# EAGLE design rifting_bronx_eden (EAGLE 9.6.2)
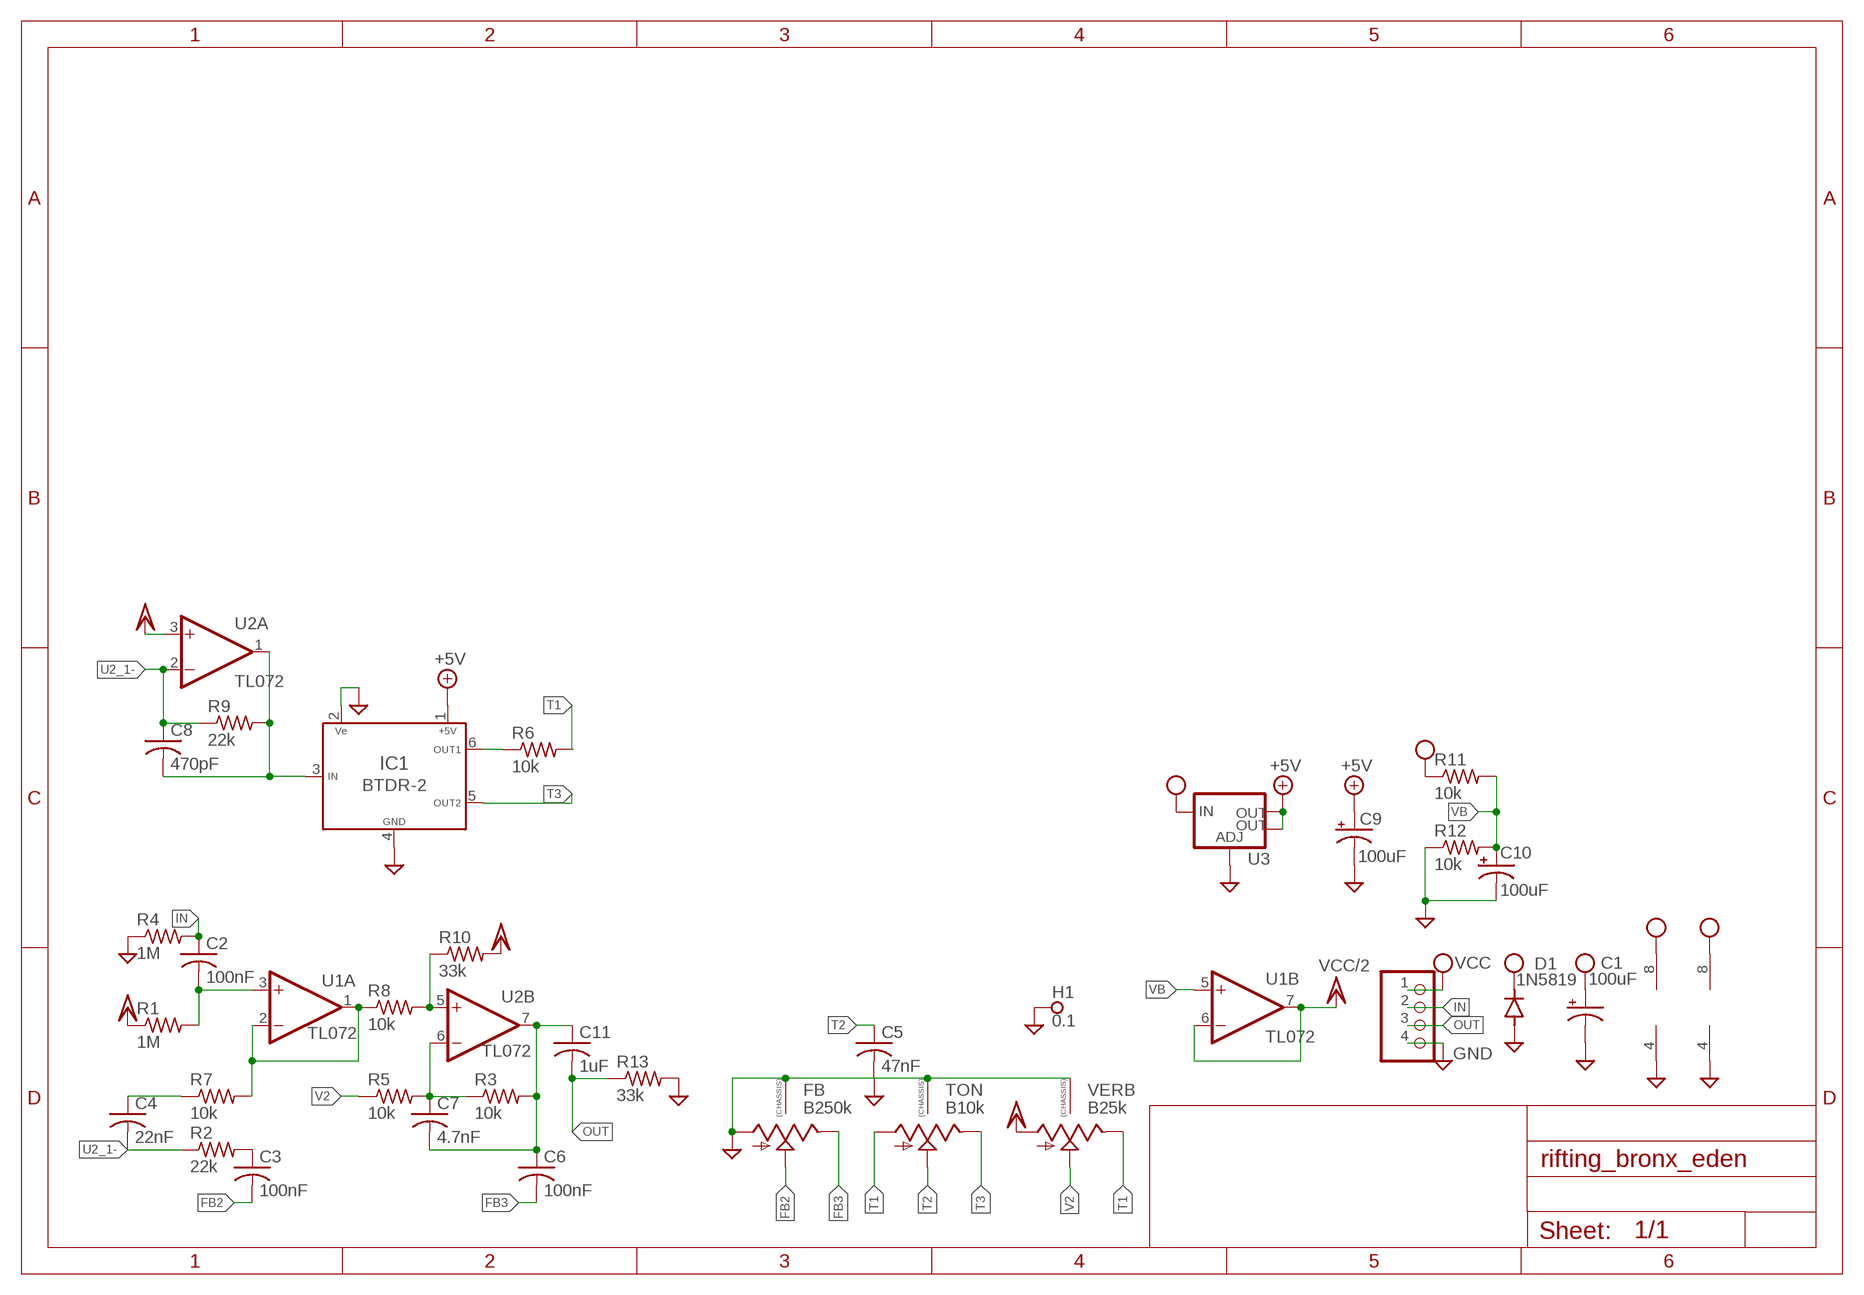
[diagram p0: schematic, sheet 1]

## Parts
C1  100uF  CAP_SMD+THRUPAN_B  [PAN_B_SMD+THRU]
C2  100nF  C-USC0603  [C0603]
C3  100nF  C-USC0603  [C0603]
C4  22nF  C-USC0603  [C0603]
C5  47nF  C-USC0603  [C0603]
C6  100nF  C-USC0603  [C0603]
C7  4.7nF  C-USC0603  [C0603]
C8  470pF  C-USC0603  [C0603]
C9  100uF  CAP_SMD+THRUPAN_B  [PAN_B_SMD+THRU]
C10  100uF  CAP_SMD+THRUPAN_B  [PAN_B_SMD+THRU]
C11  1uF  C-USC0603  [C0603]
D1  1N5819  DIODE-SOD123  [SOD123]
FB  B250k  9MM_SNAP-IN_POT_CHASSIS  [9MM_SNAP-IN_POT]
H1  0.1  SPECIAL_DRILL_0.1000  [PAD_0.1000]
IC1  BTDR-2  [BTDR-2]
JP1  PINHD-1X4  [1X04]
R1  1M  R-US_R0603  [R0603]
R2  22k  R-US_R0603  [R0603]
R3  10k  R-US_R0603  [R0603]
R4  1M  R-US_R0603  [R0603]
R5  10k  R-US_R0603  [R0603]
R6  10k  R-US_R0603  [R0603]
R7  10k  R-US_R0603  [R0603]
R8  10k  R-US_R0603  [R0603]
R9  22k  R-US_R0603  [R0603]
R10  33k  R-US_R0603  [R0603]
R11  10k  R-US_R0603  [R0603]
R12  10k  R-US_R0603  [R0603]
R13  33k  R-US_R0603  [R0603]
TON  B10k  9MM_SNAP-IN_POT_CHASSIS  [9MM_SNAP-IN_POT]
U1  TL072  TL072TSSOP  [TSSOP-8]
U2  TL072  TL072TSSOP  [TSSOP-8]
U3  V_REG_LM1117SOT223  [SOT223]
VERB  B25k  9MM_SNAP-IN_POT_CHASSIS  [9MM_SNAP-IN_POT]

## Nets
+5V: C9.+ C9.++(+) IC1.1 U3.2(OUT) U3.4(OUT)
FB2: C3.2 FB.2(S)
FB3: C6.2 FB.3(E)
GND: C1.- C1.--(-) C5.2 C9.- C9.--(-) C10.- C10.--(-) D1.A FB.1(A) FB.CHASSIS1 FB.CHASSIS2 H1.1 IC1.2 IC1.4 JP1.4 R4.1 R12.1 R13.2 TON.CHASSIS1 TON.CHASSIS2 U1.4(P:V-) U2.4(P:V-) U3.1(ADJ) VERB.CHASSIS1 VERB.CHASSIS2
IN: C2.1 JP1.2 R4.2
N$1: C4.1 R7.1
N$2: C2.2 R1.2 U1.3(A:+IN)
N$3: R7.2 R8.1 U1.1(A:OUT) U1.2(A:-IN)
N$4: C3.1 R2.2
N$5: R8.2 R10.1 U2.5(B:+IN)
N$6: C7.1 R3.1 R5.2 U2.6(B:-IN)
N$7: C6.1 C7.2 C11.1 R3.2 U2.7(B:OUT)
N$8: IC1.6 R6.1
N$9: C8.2 IC1.3 R9.2 U2.1(A:OUT)
OUT: C11.2 JP1.3 R13.1
T1: R6.2 TON.1(A) VERB.3(E)
T2: C5.1 TON.2(S)
T3: IC1.5 TON.3(E)
U2_1-: C4.2 C8.1 R2.1 R9.1 U2.2(A:-IN)
V2: R5.1 VERB.2(S)
VB: C10.+ C10.++(+) R11.2 R12.2 U1.5(B:+IN)
VCC: C1.+ C1.++(+) D1.C JP1.1 R11.1 U1.8(P:V+) U2.8(P:V+) U3.3(IN)
VCC/2: R1.1 R10.2 U1.6(B:-IN) U1.7(B:OUT) U2.3(A:+IN) VERB.1(A)

## Library data of the parts
C1 C9 C10 = MusicThingModular:CAP_SMD+THRU
C2-C8 C11 = adafruit:C-US: CAPACITOR, American symbol
D1 = diode:DIODE-: DIODE
FB TON VERB = MusicThingModular:9MM_SNAP-IN_POT_CHASSIS: 9mm vertical snap-in pot, Alpha / Panasonic style, with a connection to the metal chassis for grounding
H1 = special-drill:SPECIAL_DRILL_: Special drills
IC1 = integrated circuits:BTDR-2: Reverb BTDR-2H: http://smallbear-electronics.mybigcommerce.com/belton-btdr-2h-reverb-modules/
JP1 = Connector:PINHD-1X4: PIN HEADER; CATEGORY: CONNECTOR; SUB-CATEGORY: PIN-HEADER
R1-R13 = adafruit:R-US_: RESISTOR, American symbol
U1 U2 = MusicThingModular:TL072: Generic Dual Op Amp
U3 = SparkFun-IC-Power:V_REG_LM1117: Voltage Regulator LM1117 Standard adjustable voltage regulator but in SMD form. Spark Fun Electronics SKU : COM-00595; PROD_ID: VREG-08170

## Board
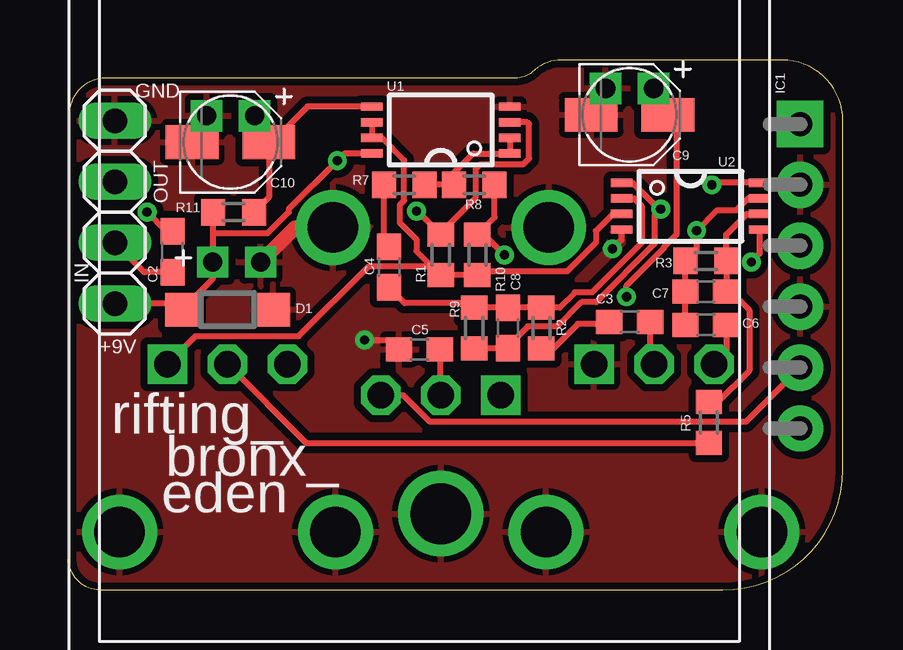
[diagram p1: board, top side]
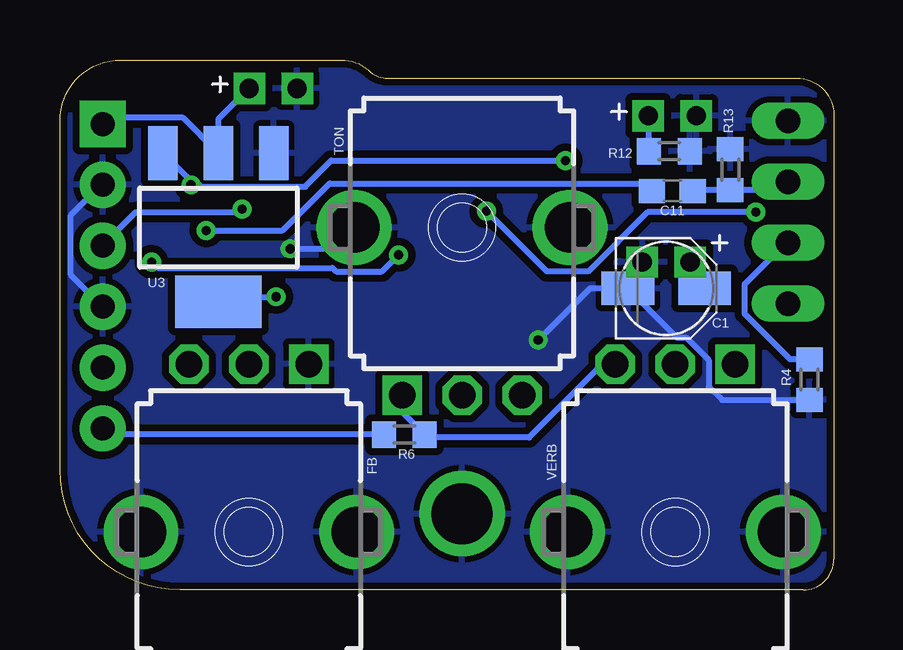
[diagram p2: board, bottom side, seen from below]

Size 32.26 x 22.1 mm. Coordinates in mm from the lower left corner, seen from the top.
Outline: 0,19.81 0,1.27 arc90 1.27,0 27.26,0 arc90 32.26,5 32.26,19.56 arc90 29.72,22.1 20.53,22.1 arc45 19.3,21.59 arc-45 18.51,21.34 1.52,21.34 arc90 0,19.81
Copper layers (1*16): Top 0.035mm / dielectric 1.5mm / Bottom 0.035mm
Design rules "default *": minimum track width 6mil, minimum drill 0.35mm, track to track 6mil, track to pad 6mil, pad to pad 6mil, via to via 6mil, smd to smd 6mil, copper to edge 10mil, drill to drill 6mil, minimum pad ring 10mil, minimum via ring 8mil, stop-mask expansion 4mil, vias tented up to drill 0mil, thermal gap 10mil

### Footprints (pad centres in the part's own frame; a part is rotated, then mirrored left to right if it is on the bottom)
PAN_B_SMD+THRU = smd 2.2 x 1.4: + 1.6,0; - -1.6,0 | drill 0.8 pad 0.9 square: ++ 1,1.1; -- -1,1.1
C0603 = smd 1.1 x 1: 1 -0.85,0; 2 0.85,0
SOD123 = smd 1.4 x 1.4: A 1.9,0; C -1.9,0
9MM_SNAP-IN_POT = drill 1.1 square: 1 -2.5,-7 | drill 1.1 octagon: 2 0,-7; 3 2.5,-7 | drill 2.1 pad 2.794: CHASSIS1 -4.5,0; CHASSIS2 4.5,0
PAD_0.1000 = drill 2.54 pad 2.54: 1 0,0
BTDR-2 = drill 1 pad 1.93 square: 1 5.08,-15.875 | drill 1 pad 1.93: 2 2.54,-15.875; 3 0,-15.875; 4 -2.54,-15.875; 5 -5.08,-15.875; 6 -7.62,-15.875
1X04 = drill 1.016 long: 1 -3.81,0; 2 -1.27,0; 3 1.27,0; 4 3.81,0
R0603 = smd 1 x 1.1: 1 -0.85,0; 2 0.85,0
TSSOP-8 = smd 0.9 x 0.35: 1 -2.875,0.975; 2 -2.875,0.325; 3 -2.875,-0.325; 4 -2.875,-0.975; 5 2.875,-0.975; 6 2.875,-0.325; 7 2.875,0.325; 8 2.875,0.975
SOT223 = smd 1.219 x 2.235: 1 -2.311,-3.099; 2 0,-3.099; 3 2.311,-3.099 | smd 3.6 x 2.2: 4 0,3.099

### Placement (x,y rotation side)
C1  6.99,12.57 0 bottom
C2  4.32,14.1 90 top
C3  23.37,11.18 0 top
C4  13.34,13.46 270 top
C5  14.61,10.03 180 top
C6  26.54,11.05 0 top
C7  26.54,12.45 180 top
C8  18.29,10.92 270 top
C9  23.37,19.81 0 top
C10  6.73,18.67 0 top
C11  6.73,16.64 0 bottom
D1  6.6,11.68 0 top
FB  24.38,2.41 180 bottom
H1  15.49,3.17 0 top
IC1  14.61,14.35 90 top
JP1  1.91,15.75 90 top
R1  15.49,13.97 90 top
R2  19.68,10.92 270 top
R3  26.54,13.72 180 top
R4  1.02,8.76 90 bottom
R5  26.67,6.99 90 top
R6  17.91,6.48 0 bottom
R7  13.97,16.89 0 top
R8  16.89,16.89 0 top
R9  16.89,10.92 270 top
R10  17.02,13.97 270 top
R11  6.86,15.75 0 top
R12  6.86,18.29 180 bottom
R13  4.32,17.53 90 bottom
TON  15.49,15.11 0 bottom
U1  15.49,19.18 180 top
U2  25.91,16 0 top
U3  25.65,15.11 180 bottom
VERB  6.6,2.41 180 bottom

### Tracks (layer width: path | path; a pad name or v marks a point on that pad's centre or on a via)
+5V  (via drill 0.38)
  Top 0.254: C9.++ 24.37,20.41 C9.+ 25.34,19.46 25.34,14.83 24.82,14.31 24.82,14.27 23.24,12.69 v23.24,12.22
  Bottom 0.254: C9.++ 25.65,19.63 U3.2 27.13,19.68 30.23,19.68 IC1.1 | U3.4 25.45,12.22 v23.24,12.22
FB2
  Top 0.254: C3.2 24.22,9.58 FB.2
FB3
  Top 0.254: C6.2 27.39,9.92 FB.3
GND  (via drill 0.38)
  Top 0.254: v12.32,10.41 13.37,10.41 C5.2 | U2.4 23.03,14.6 v22.66,14.22
  Top 0.61: C1.-- 9.43,15.11 TON.CHASSIS2
  Bottom 0.254: C1.- 10.16,12.57 v12.32,10.41 | C1.- 6.53,10.52 6.15,10.52 5.21,9.58 5.21,8.47 4.65,7.91 R4.1 | IC1.4 31.8,13.13 31.8,15.62 30.53,16.89 IC1.2 | v22.66,14.22 20.88,14.22 TON.CHASSIS1 | C1.-- 7.99,13.17 C1.-
  pour Top (isolate 0.305): -1.27,22.86 -1.27,-5.08 33.02,-5.08 33.02,22.86
  pour Bottom (isolate 0.305): -1.27,22.86 -1.27,-5.08 33.02,-5.08 33.02,22.86
IN
  Top 0.254: C2.1 3.14,13.25 JP1.2
  Bottom 0.254: R4.2 1.81,9.61 3.71,11.51 3.71,12.75 1.98,14.48 JP1.2
N$1
  Top 0.254: C4.1 13.12,14.53 R7.1
N$2  (via drill 0.38)
  Top 0.254: U1.3 19.11,19.5 19.18,19.43 19.18,17.99 18.93,17.75 17.15,17.75 16.96,17.56 16.96,16.37 15.49,14.9 R1.2 14.52,15.79 v14.48,15.79 | C2.2 4.05,14.95 v3.25,15.75
  Bottom 0.254: v3.25,15.75 7.76,15.75 10.23,13.28 11.96,13.28 v14.48,15.79
N$3
  Top 0.254: U1.2 U1.1 16.84,18.2 16.04,17.4 R8.1 R7.2
N$4
  Top 0.254: C3.1 22.43,11.09 21.21,11.09 20.19,10.07 R2.2
N$5  (via drill 0.38)
  Top 0.254: R8.2 17.74,15.54 R10.1 17.29,14.82 v18.14,13.97 | U2.5 28.78,14.02 v28.44,13.68
  Bottom 0.254: v28.44,13.68 28.18,13.42 20.9,13.42 20.75,13.28 18.84,13.28 v18.14,13.97
N$6
  Top 0.254: U2.6 28.25,15.68 27.39,14.82 R3.1 C7.1 27.57,12.45 28.35,11.66 28.35,9.13 27.05,7.83 R5.2
N$7  (via drill 0.38)
  Top 0.254: C6.1 C7.2 R3.2 26.16,14.19 v26.16,14.99 27.01,15.84 27.81,15.84 28.3,16.33 U2.7
  Bottom 0.254: v26.16,14.99 22.97,14.99 21.01,16.95 7.89,16.95 C11.1
N$8
  Bottom 0.254: R6.1 30.23,6.48 IC1.6
N$9  (via drill 0.38)
  Top 0.254: R9.2 C8.2 18.29,10.16 19.12,10.99 20.35,10.99 21.36,12 21.97,12 24.41,14.44 24.41,15.62 v24.66,15.88 24.58,15.88 23.48,16.98 U2.1
  Bottom 0.254: IC1.3 30.48,14.38 29.11,15.75 24.79,15.75 v24.66,15.88
OUT
  Bottom 0.254: JP1.3 2.25,16.68 R13.1 5.84,16.68 C11.2
T1
  Bottom 0.254: TON.1 17.99,7.41 R6.2 16.93,6.35 12.7,6.35 9.64,9.41 VERB.3
T2
  Top 0.254: C5.1 15.46,8.15 TON.2
T3
  Top 0.254: TON.3 13.93,8.11 15.04,7.01 28.22,7.01 IC1.5
U2_1-
  Top 0.254: U2.2 23.55,16.33 23.88,16 23.88,14.48 21.8,12.41 21.08,12.41 20.45,11.77 R2.1 C8.1 R9.1 16.51,11.77 16.32,11.96 13.99,11.96 C4.2
V2
  Top 0.254: VERB.2 9.88,6.13 R5.1
VB
  Top 0.254: C10.++ 7.73,19.27 C10.+ 8.33,18.54 | 8.33,18.54 8.33,16.37 R11.2 | U1.5 9.94,20.15 8.33,18.54
  Bottom 0.254: R12.2 7.71,19.75 C10.++
VCC  (via drill 0.38)
  Top 0.254: 6.01,14.86 6.01,13.7 C1.++ 5.99,12.96 D1.C 4.45,11.94 JP1.1 | 6.01,14.86 R11.1 | U1.8 11.48,18.2 v11.18,17.9 9.16,15.87 9.16,15.75 8.26,14.86 6.01,14.86 | v26.8,16.89 26.88,16.98 U2.8
  Bottom 0.254: C1.+ 5.99,13.17 C1.++ | U3.3 26.8,17.04 v26.8,16.89 26.46,16.89 26.38,16.82 22.03,16.82 20.95,17.9 v11.18,17.9
VCC/2
  Top 0.254: U1.6 U1.7 13.03,18.85 13.97,17.91 13.97,16.24 13.8,16.07 13.8,15.29 14.48,14.61 14.48,14.14 R1.1 | R1.1 R10.2 17.17,13.28 20.75,13.28 21.96,14.48 21.96,14.97 22.66,15.68 U2.3 | R1.1 15.13,13.48 12.48,13.48 9.57,10.58 5.27,10.58 VERB.1

### Text on the board
tPlace: GND | OUT | IN | +9V | rifting_ | bronx_ | eden